# EAGLE design Command Matrix PCB (EAGLE 6.4)

## Sheet 1 of 6
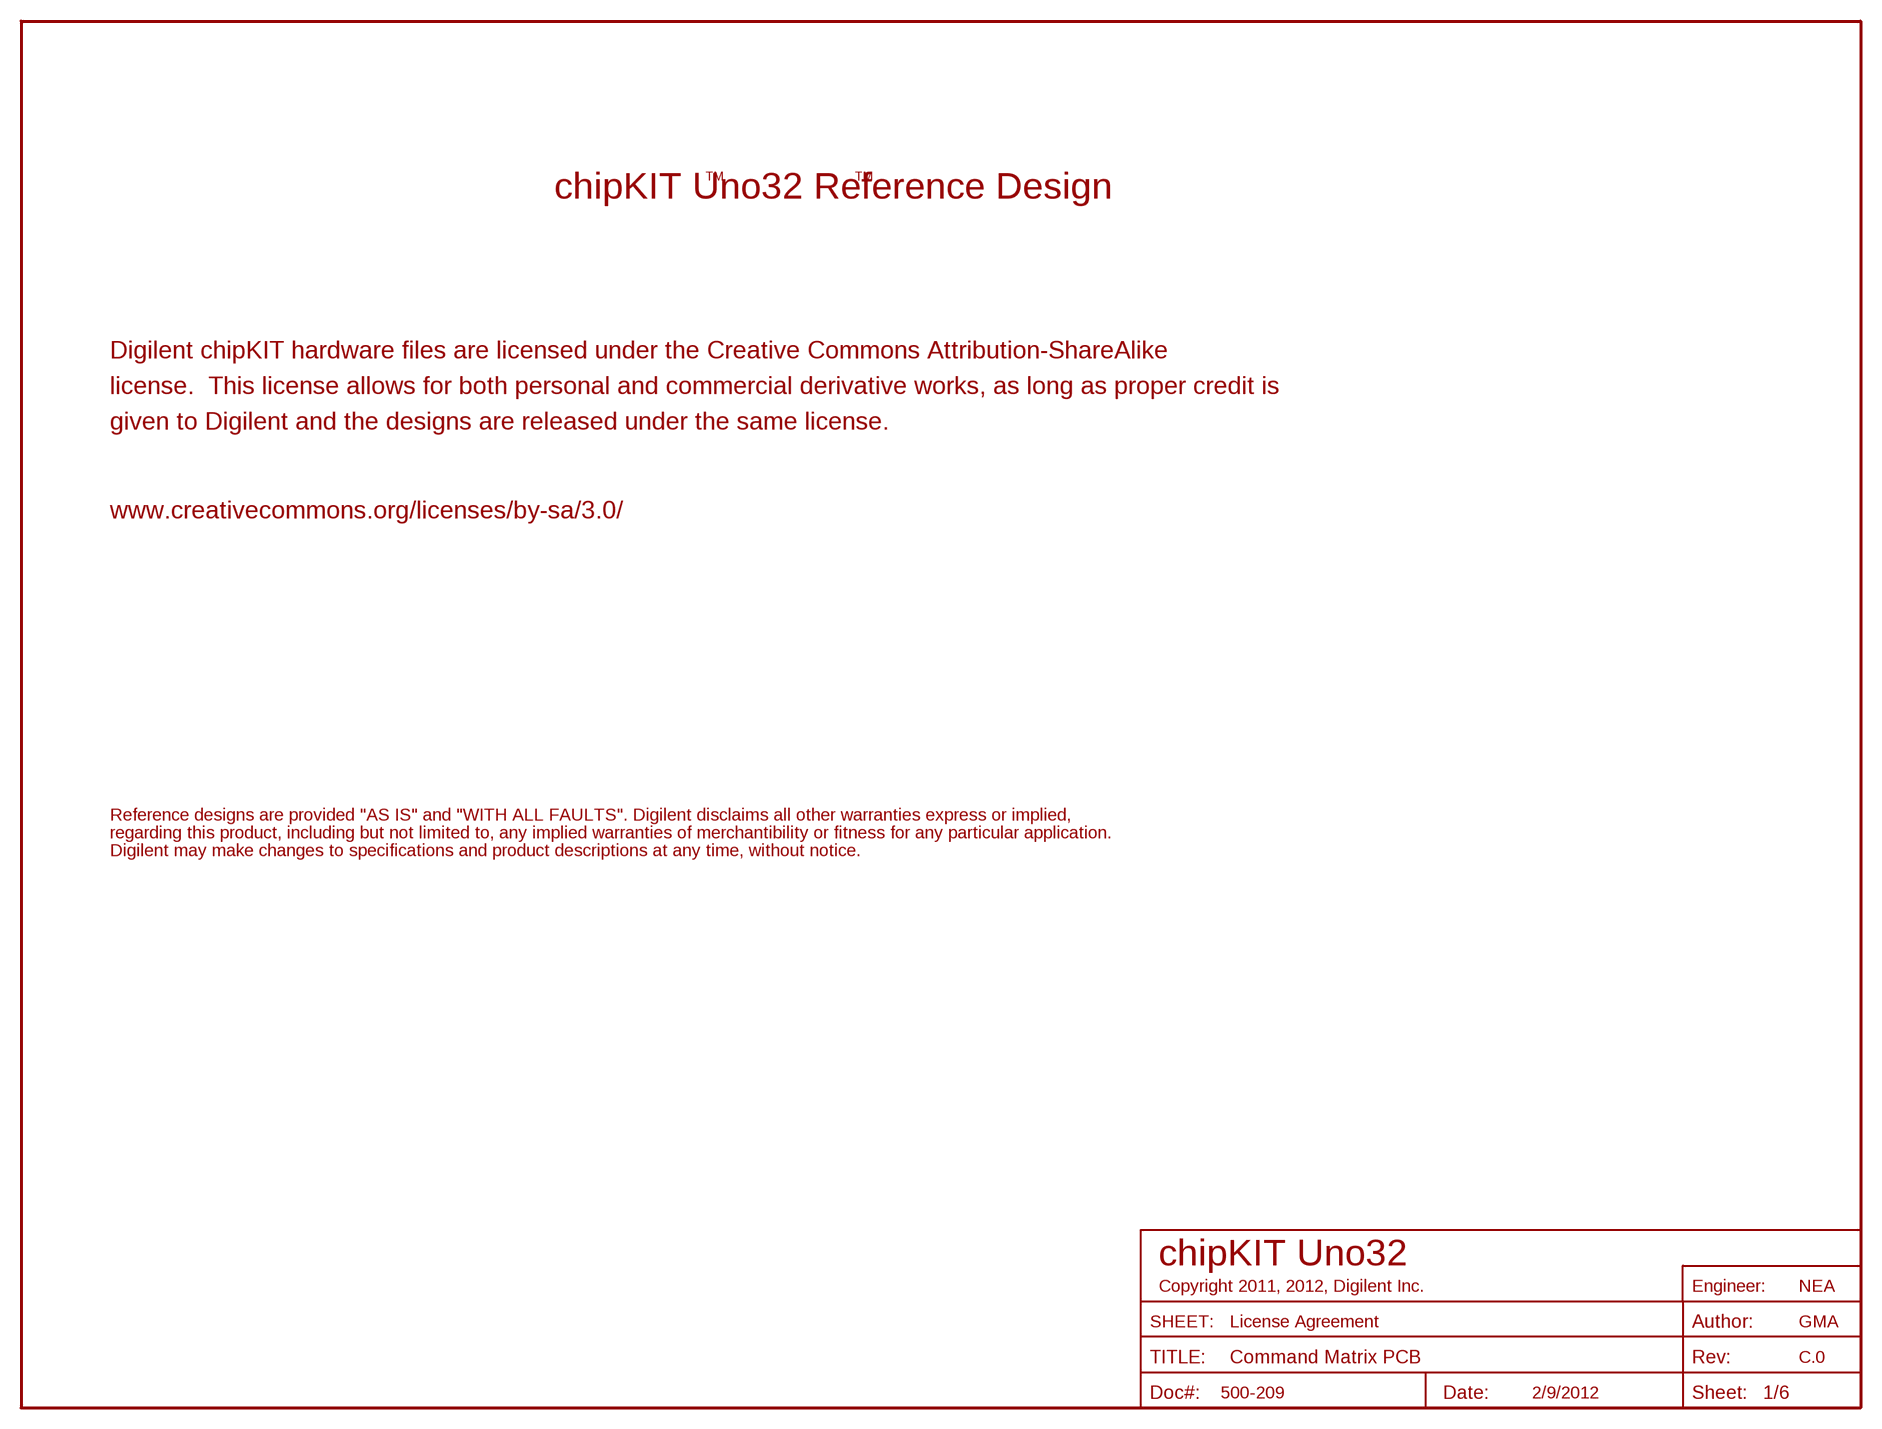
[diagram p0: schematic, sheet 1]

### Notes on the sheet
- TM | TM
- chipKIT Uno32 Reference Design
- Digilent chipKIT hardware files are licensed under the Creative Commons Attribution-ShareAlike
- license.  This license allows for both personal and commercial derivative works, as long as proper credit is
- given to Digilent and the designs are released under the same license.
- www.creativecommons.org/licenses/by-sa/3.0/
- Reference designs are provided "AS IS" and "WITH ALL FAULTS". Digilent disclaims all other warranties express or implied,
- regarding this product, including but not limited to, any implied warranties of merchantibility or fitness for any particular application.
- Digilent may make changes to specifications and product descriptions at any time, without notice.
- chipKIT Uno32
- Copyright 2011, 2012, Digilent Inc. | NEA
- License Agreement | GMA
- C.0
- 500-209 | 2/9/2012

## Sheet 2 of 6
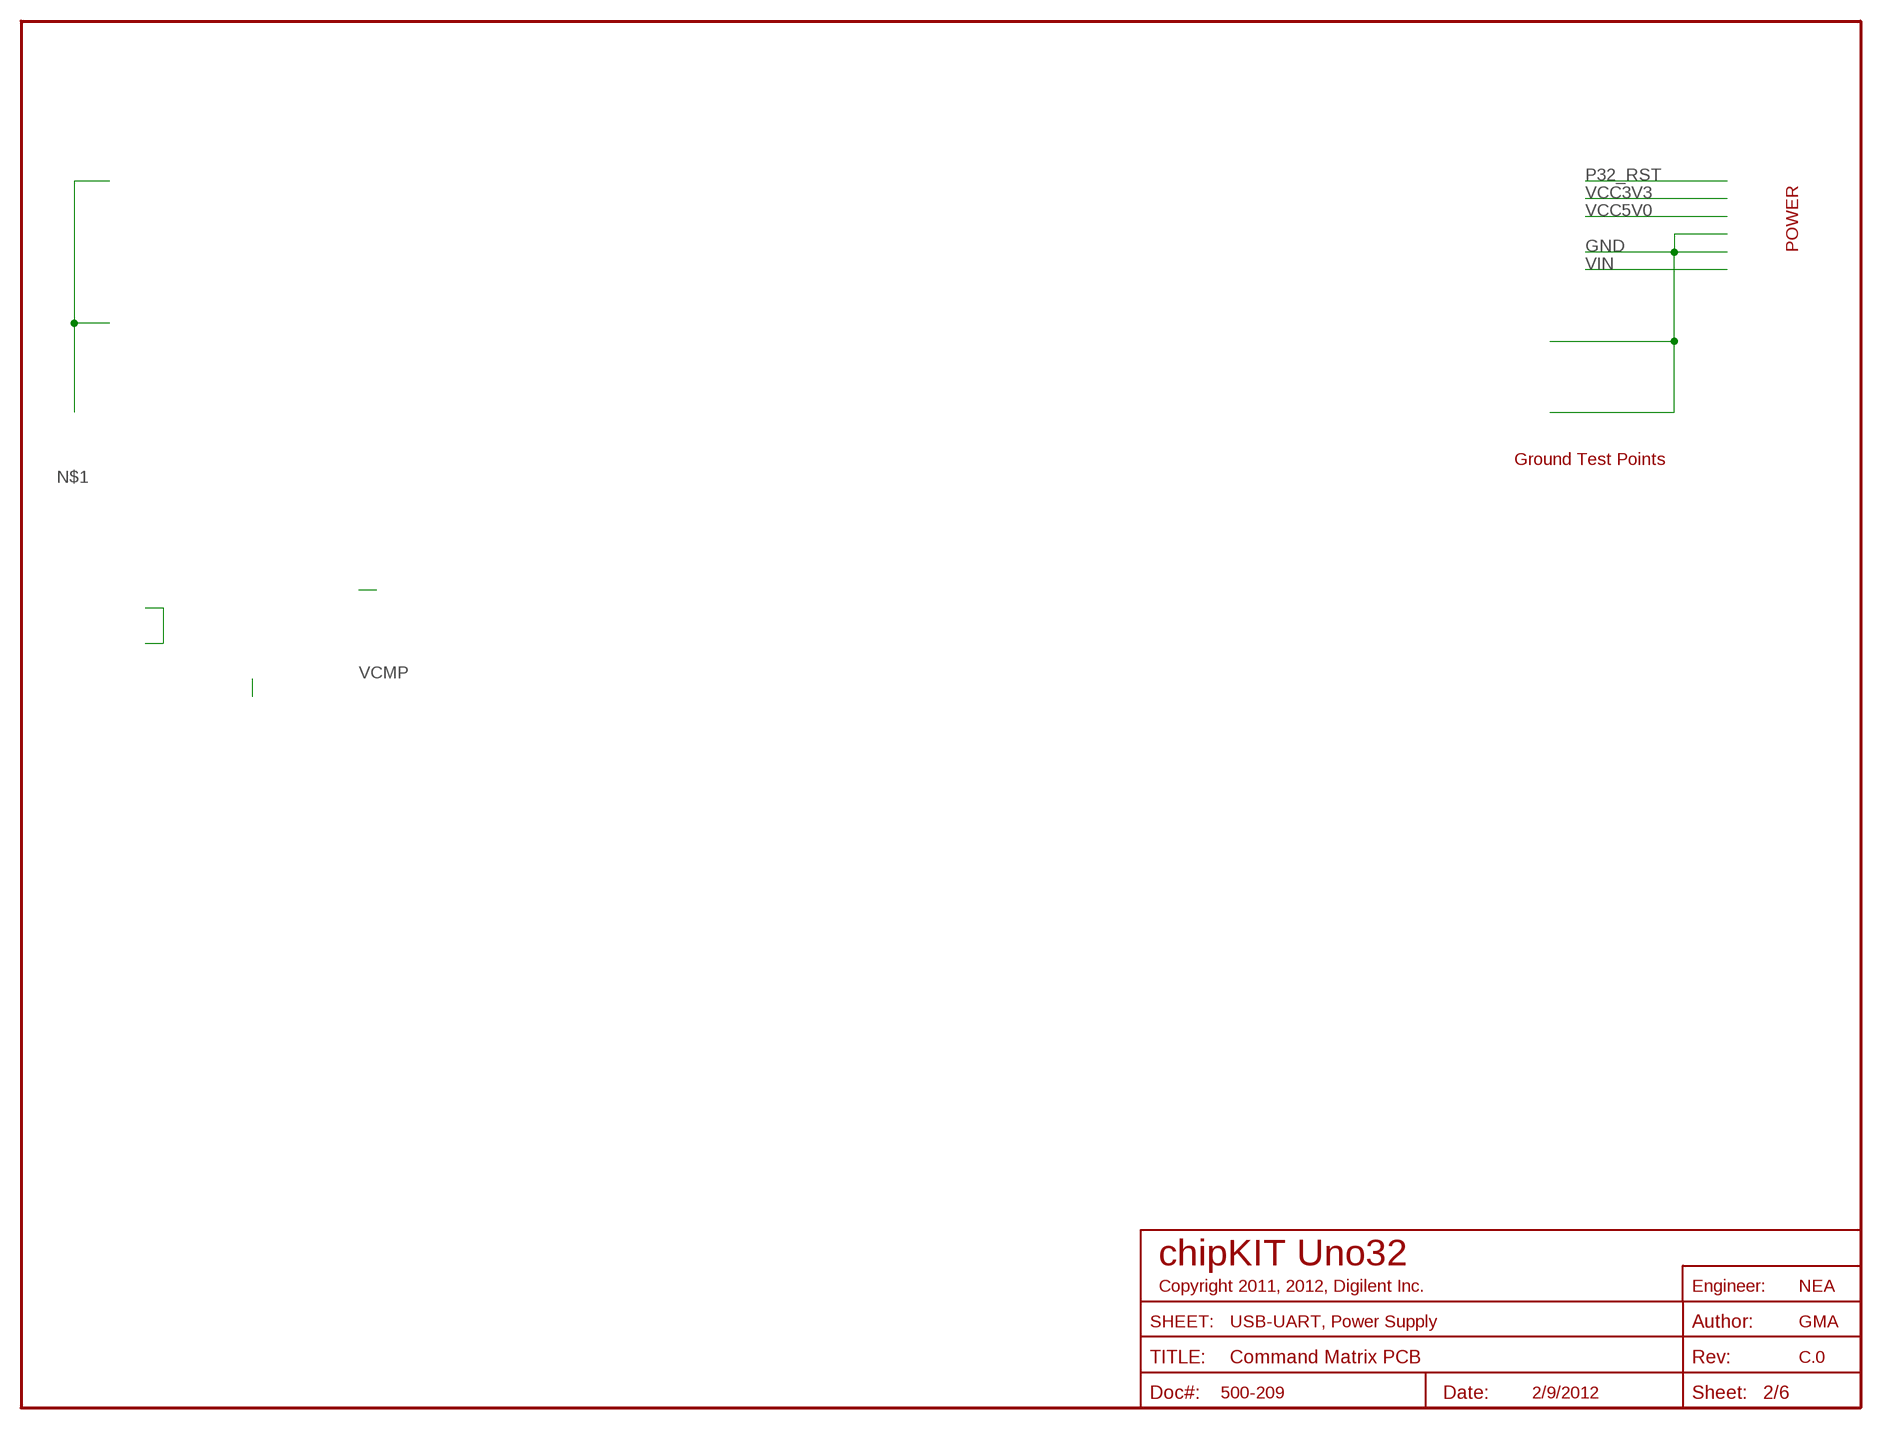
[diagram p1: schematic, sheet 2]

### Notes on the sheet
- POWER
- Ground Test Points
- chipKIT Uno32
- Copyright 2011, 2012, Digilent Inc. | NEA
- USB-UART, Power Supply | GMA
- C.0
- 500-209 | 2/9/2012

## Sheet 3 of 6
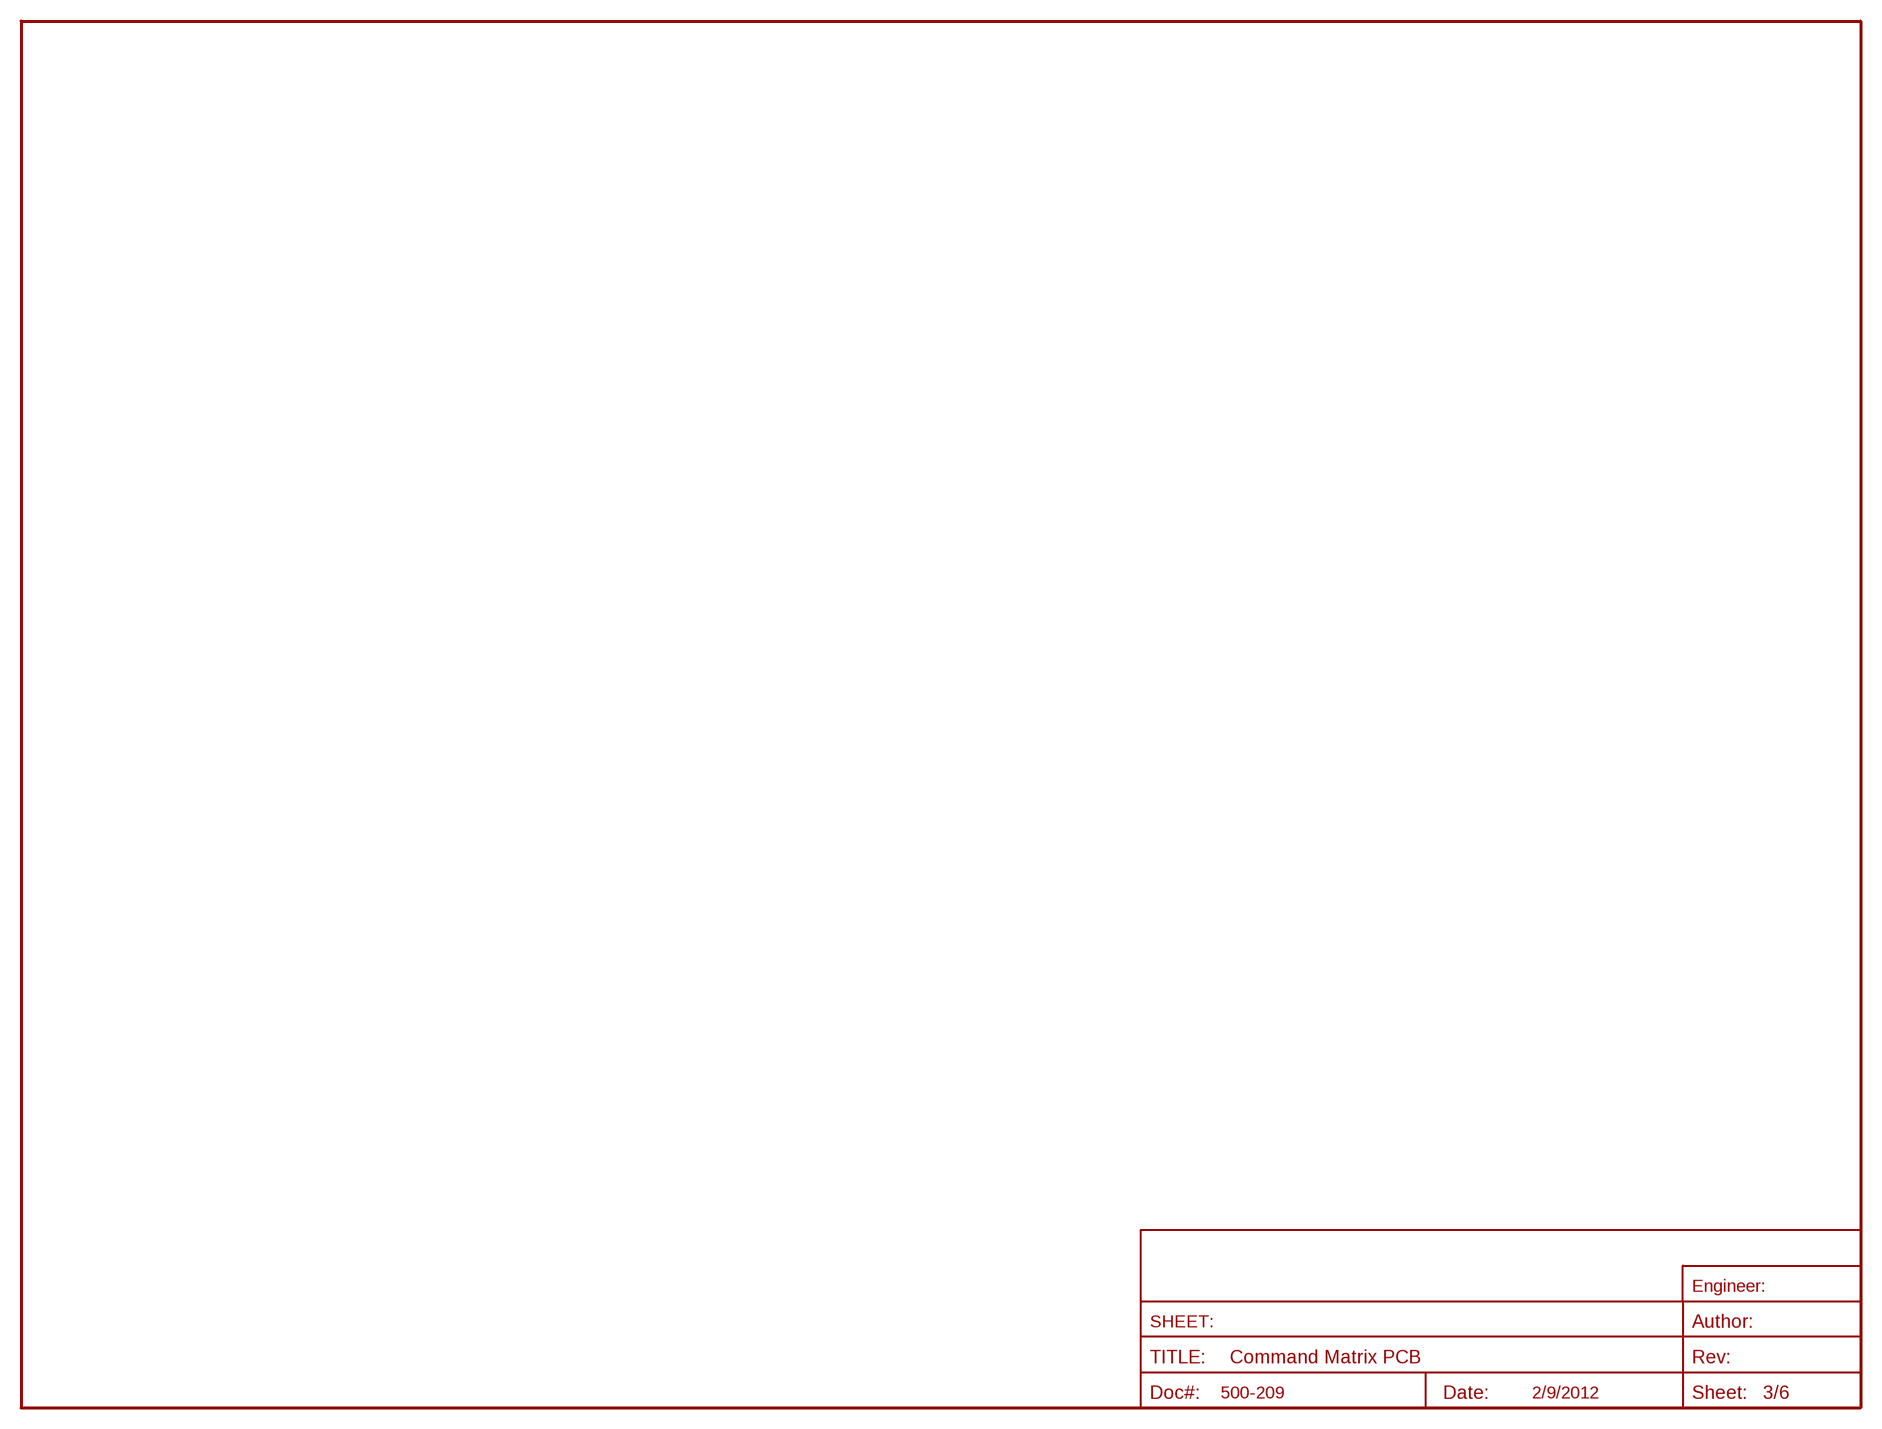
[diagram p2: schematic, sheet 3]

### Notes on the sheet
- 500-209 | 2/9/2012

## Sheet 4 of 6
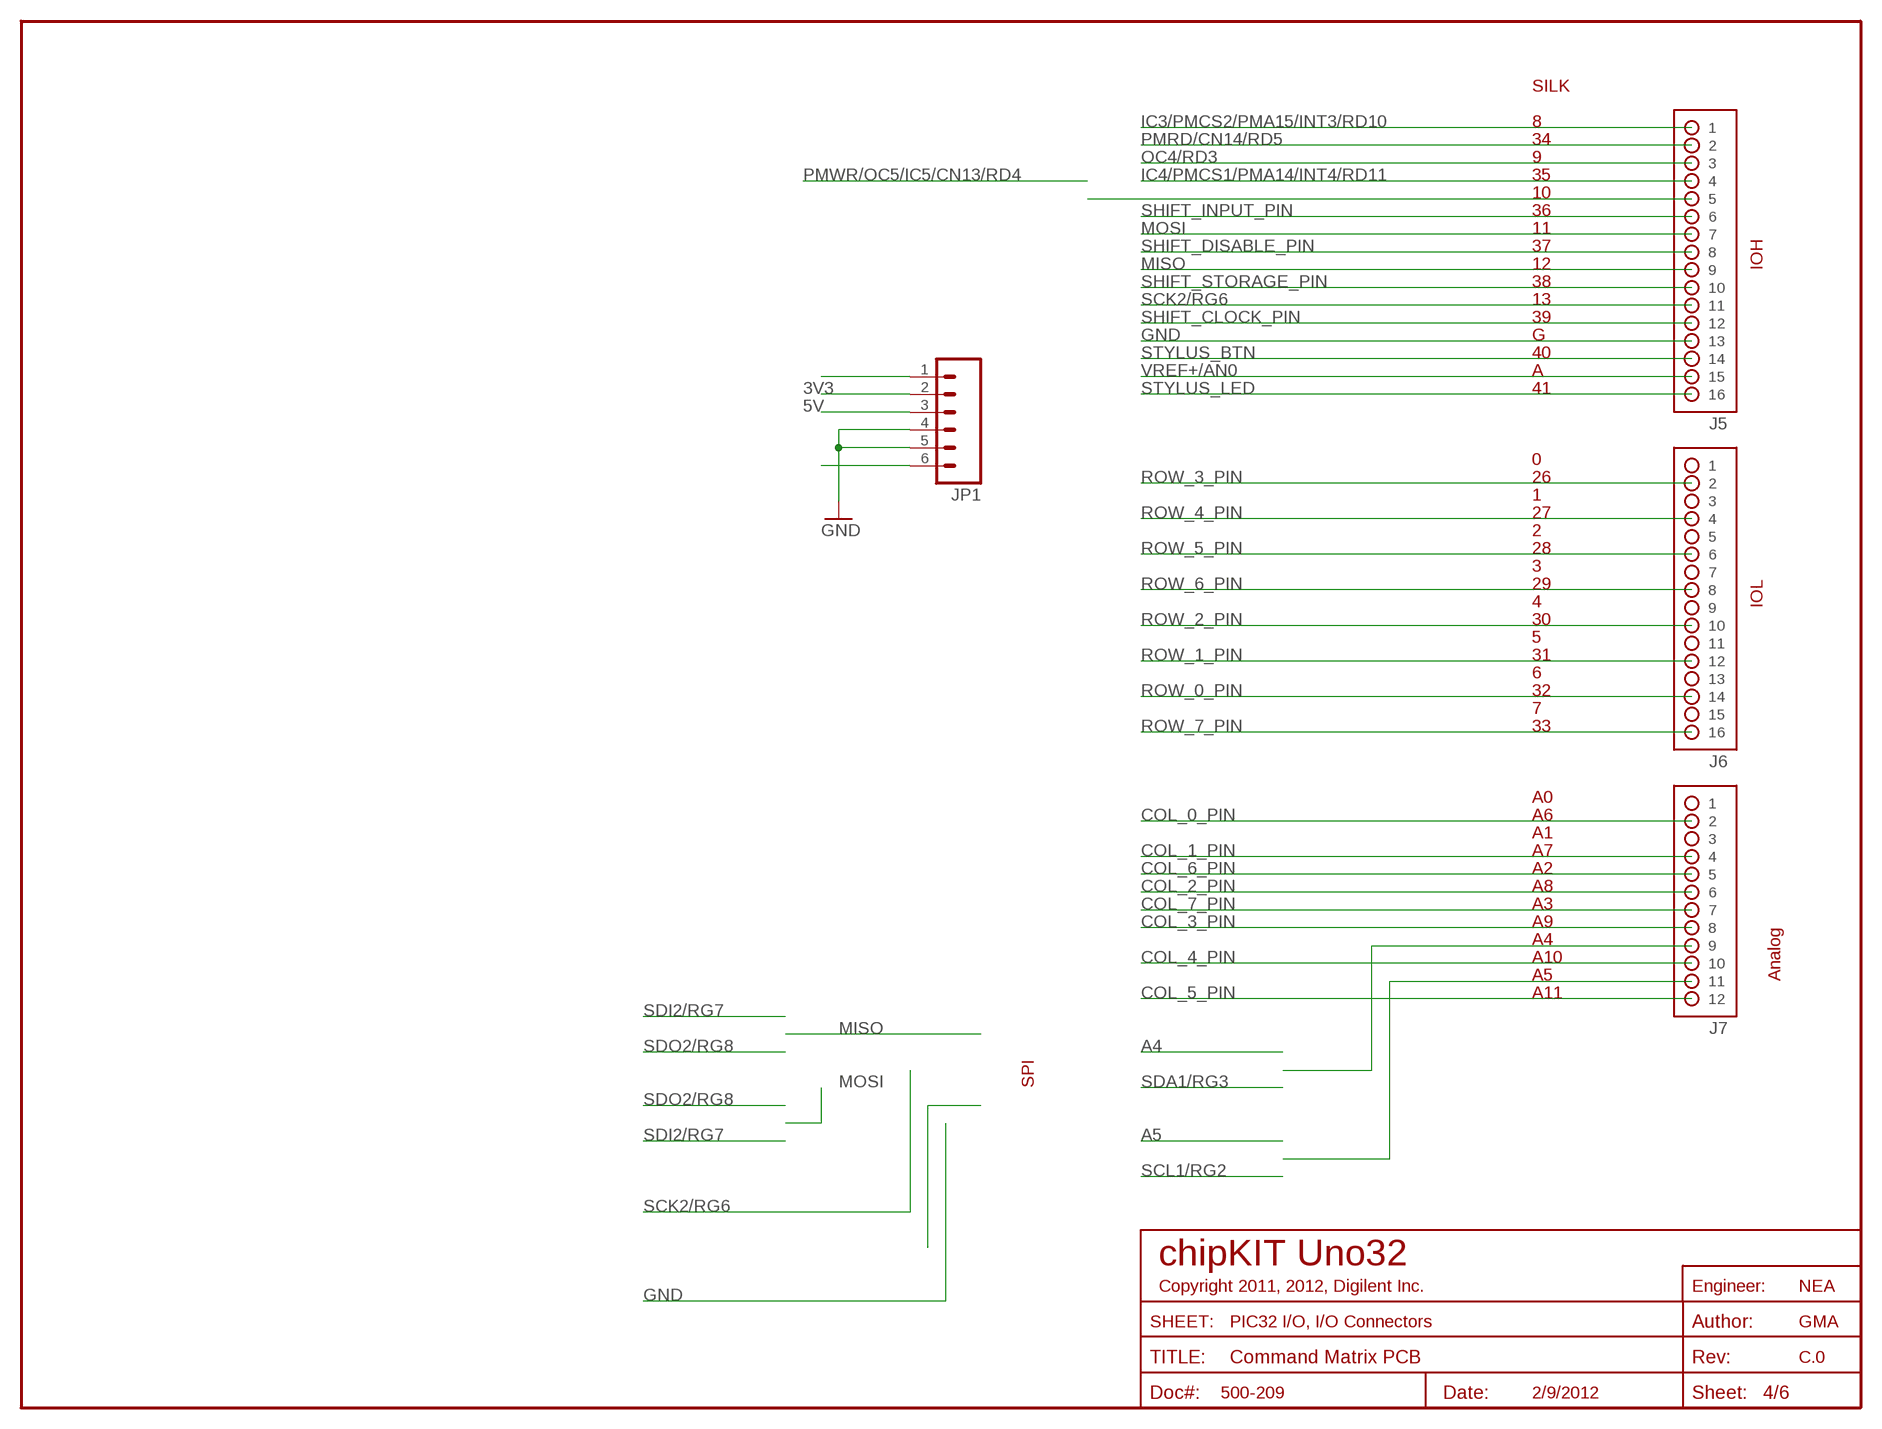
[diagram p3: schematic, sheet 4]

### Parts
J5  HDR-2X8  [HDR-2X8]
J6  HDR-2X8  [HDR-2X8]
J7  HDR-2X6  [HDR-2X6]
JP1  M06SIP  [1X06]

### Nets
3V3: JP1.2 ; also sheet 5
5V: JP1.3 ; also sheet 5
COL_0_PIN: J7.2 ; also sheet 5
COL_1_PIN: J7.4 ; also sheet 5
COL_2_PIN: J7.6 ; also sheet 5
COL_3_PIN: J7.8 ; also sheet 5
COL_4_PIN: J7.10 ; also sheet 5
COL_5_PIN: J7.12 ; also sheet 5
COL_6_PIN: J7.5 ; also sheet 5
COL_7_PIN: J7.7 ; also sheet 5
GND: J5.13 JP1.4 JP1.5 ; also sheet 2,5
IC3/PMCS2/PMA15/INT3/RD10: J5.1
IC4/PMCS1/PMA14/INT4/RD11: J5.4
MISO: J5.9
MOSI: J5.7
N$7: JP1.6
N$25: J5.5
N$32: J7.9
N$33: J7.11
OC4/RD3: J5.3
PMRD/CN14/RD5: J5.2
RESET: JP1.1
ROW_0_PIN: J6.14 ; also sheet 5
ROW_1_PIN: J6.12 ; also sheet 5
ROW_2_PIN: J6.10 ; also sheet 5
ROW_3_PIN: J6.2 ; also sheet 5
ROW_4_PIN: J6.4 ; also sheet 5
ROW_5_PIN: J6.6 ; also sheet 5
ROW_6_PIN: J6.8 ; also sheet 5
ROW_7_PIN: J6.16 ; also sheet 5
SCK2/RG6: J5.11
SHIFT_CLOCK_PIN: J5.12 ; also sheet 5
SHIFT_DISABLE_PIN: J5.8 ; also sheet 5
SHIFT_INPUT_PIN: J5.6 ; also sheet 5
SHIFT_STORAGE_PIN: J5.10 ; also sheet 5
STYLUS_BTN: J5.14 ; also sheet 5
STYLUS_LED: J5.16 ; also sheet 5
VREF+/AN0: J5.15
Unconnected: J6.1 J6.3 J6.5 J6.7 J6.9 J6.11 J6.13 J6.15 J7.1 J7.3

### Notes on the sheet
- SILK
- 8
- 34
- 9
- 35
- 10
- 36
- 11
- 37
- 12 | IOH
- 38
- 13
- 39
- G
- 40
- A
- 41
- 0
- 26
- 1
- 27
- 2
- 28
- 3
- 29
- 4 | IOL
- 30
- 5
- 31
- 6
- 32
- 7
- 33
- A0
- A6
- A1
- A7
- A2
- A8
- A3
- A9
- A4
- A10
- A5 | Analog
- A11
- SPI
- chipKIT Uno32
- Copyright 2011, 2012, Digilent Inc. | NEA
- PIC32 I/O, I/O Connectors | GMA
- C.0
- 500-209 | 2/9/2012

## Sheet 5 of 6
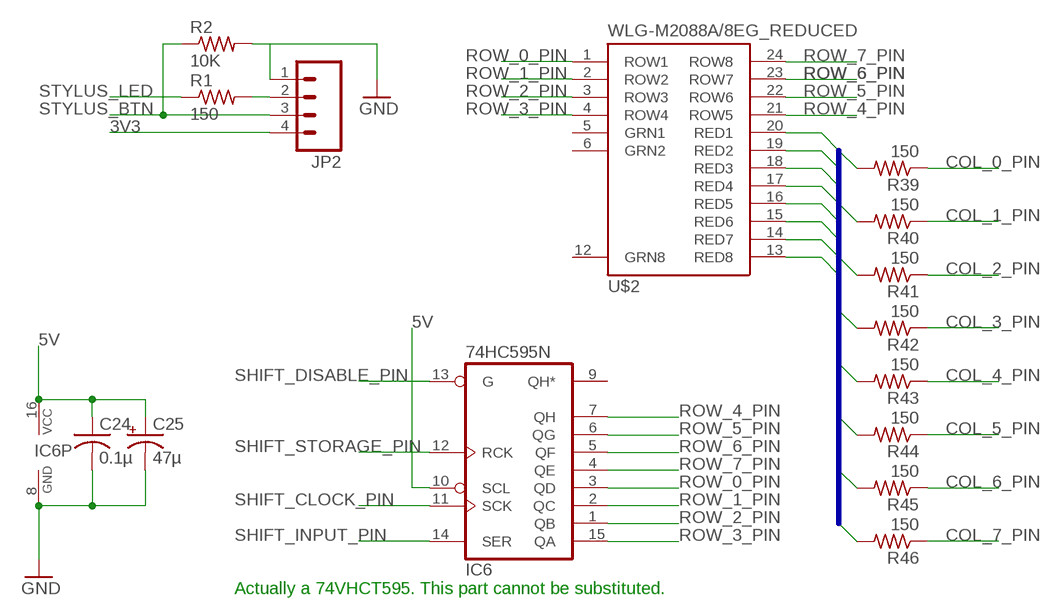
[diagram p4: schematic, sheet 5]

### Parts
C24  0.1µ  C-US025-025X050  [C025-025X050]
C25  47µ  CPOL-USE2,5-6E  [E2,5-6E]
IC6  74HC595N  [DIL16]
JP2  M04PTH  [1X04]
R1  150  R-US_0207/10  [0207/10]
R2  10K  R-US_0207/10  [0207/10]
R39  150  R-US_0207/10  [0207/10]
R40  150  R-US_0207/10  [0207/10]
R41  150  R-US_0207/10  [0207/10]
R42  150  R-US_0207/10  [0207/10]
R43  150  R-US_0207/10  [0207/10]
R44  150  R-US_0207/10  [0207/10]
R45  150  R-US_0207/10  [0207/10]
R46  150  R-US_0207/10  [0207/10]
U$2  WLG-M2088A/8EG_REDUCED  [WLG-M2088A/8EG_REDUCED]

### Nets
3V3: JP2.4 ; also sheet 4
5V: C24.1 C25.+ IC6.10(SCL) IC6.16(VCC) ; also sheet 4
COL_0_PIN: R39.1 ; also sheet 4
COL_1_PIN: R40.1 ; also sheet 4
COL_2_PIN: R41.1 ; also sheet 4
COL_3_PIN: R42.1 ; also sheet 4
COL_4_PIN: R43.1 ; also sheet 4
COL_5_PIN: R44.1 ; also sheet 4
COL_6_PIN: R45.1 ; also sheet 4
COL_7_PIN: R46.1 ; also sheet 4
COLUMN_0: R39.2 U$2.20(RED1)
COLUMN_1: R40.2 U$2.19(RED2)
COLUMN_2: R41.2 U$2.18(RED3)
COLUMN_3: R42.2 U$2.17(RED4)
COLUMN_4: R43.2 U$2.16(RED5)
COLUMN_5: R44.2 U$2.15(RED6)
COLUMN_6: R45.2 U$2.14(RED7)
COLUMN_7: R46.2 U$2.13(RED8)
GND: C24.2 C25.- IC6.8(GND) JP2.1 R2.2 ; also sheet 2,4
N$3: JP2.2 R1.2
ROW_0_PIN: IC6.3(QD) U$2.1(ROW1) ; also sheet 4
ROW_1_PIN: IC6.2(QC) U$2.2(ROW2) ; also sheet 4
ROW_2_PIN: IC6.1(QB) U$2.3(ROW3) ; also sheet 4
ROW_3_PIN: IC6.15(QA) U$2.4(ROW4) ; also sheet 4
ROW_4_PIN: IC6.7(QH) U$2.21(ROW5) ; also sheet 4
ROW_5_PIN: IC6.6(QG) U$2.22(ROW6) ; also sheet 4
ROW_6_PIN: IC6.5(QF) U$2.23(ROW7) ; also sheet 4
ROW_7_PIN: IC6.4(QE) U$2.24(ROW8) ; also sheet 4
SHIFT_CLOCK_PIN: IC6.11(SCK) ; also sheet 4
SHIFT_DISABLE_PIN: IC6.13(G) ; also sheet 4
SHIFT_INPUT_PIN: IC6.14(SER) ; also sheet 4
SHIFT_STORAGE_PIN: IC6.12(RCK) ; also sheet 4
STYLUS_BTN: JP2.3 R2.1 ; also sheet 4
STYLUS_LED: R1.1 ; also sheet 4
Unconnected: IC6.9(QH*) U$2.5(GRN1) U$2.6(GRN2) U$2.12(GRN8)

### Buses
COLUMN_[0..7]

### Notes on the sheet
- Actually a 74VHCT595. This part cannot be substituted.

## Sheet 6 of 6
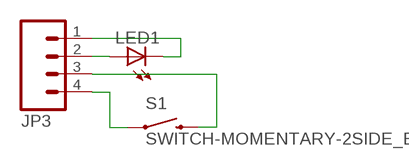
[diagram p5: schematic, sheet 6]

### Parts
JP3  M04PTH  [1X04]
LED1  LEDSIDEWAYS  [LEDSIDEWAYS]
S1  SWITCH-MOMENTARY-2SIDE_EZ  [TACTILE-PTH-SIDEEZ]

### Nets
N$4: JP3.2 LED1.P$1(A)
N$5: JP3.1 LED1.P$2(C)
N$6: JP3.3 S1.2
N$8: JP3.4 S1.1

## Library data of the parts
C24 = rcl:C-US: CAPACITOR, American symbol
C25 = rcl:CPOL-US: POLARIZED CAPACITOR, American symbol
IC6 = 74xx-eu:74*595: 8-bit SHIFT REGISTER, output latch
J5 J6 = Mechanical:HDR-2X8: 100mil 2x8 header
J7 = Mechanical:HDR-2X6: 2x6 header with 42mil holes and 100mil spacing
JP1 = SparkFun-Connectors:M06: Header 6 Standard 6-pin 0.1" header. Use with straight break away headers (SKU : PRT-00116), right angle break away headers (PRT-00553), swiss pins (PRT-00743), machine pins (PRT-00117), and female headers (PRT-00115). Molex polarized connector foot print use with SKU : PRT-08094 with associated crimp pins and housings. NOTES ON THE VARIANTS LOCK and LOCK_LONGPADS... This footprint was designed to help hold the alignment of a through-hole component (i.e. 6-pin header) while soldering it into place. You may notice that each hole has been shifted either up or down by 0.005 of an inch from it's more standard position (which is a perfectly straight line). This slight alteration caused the pins (the squares in the middle) to touch the edges of the holes. Because they are alternating, it causes a "brace" to hold the component in place. 0.005 has proven to be the perfect amount of "off-center" position when using our standard breakaway headers. Although looks a little odd when you look at the bare footprint, once you have a header in there, the alteration is very hard to notice. Also, if you push a header all the way into place, it is covered up entirely on the bottom side. This idea of altering the position of holes to aid alignment will be further integrated into the Sparkfun Library for other footprints. It can help hold any component with 3 or more connection pins.
JP2 JP3 = SparkFun-Connectors:M04: Header 4 Standard 4-pin 0.1" header. Use with straight break away headers (SKU : PRT-00116), right angle break away headers (PRT-00553), swiss pins (PRT-00743), machine pins (PRT-00117), and female headers (PRT-00115). Molex polarized connector foot print use with SKU : PRT-08231 with associated crimp pins and housings. 1MM SMD Version SKU: PRT-10208
LED1 = SparkFun-LED:LED: LEDs Standard schematic elements and footprints for 5mm, 3mm, 1206, and 0603 sized LEDs. 5mm - Spark Fun Electronics SKU : COM-00529 (and others)
R1 R2 R39-R46 = rcl:R-US_: RESISTOR, American symbol
S1 = SparkFun-Electromechanical:SWITCH-MOMENTARY-2: Various NO switches- pushbuttons, reed, etc
U$2 = led-matrix-v3:WLG-M2088A/8EG_REDUCED

## Board
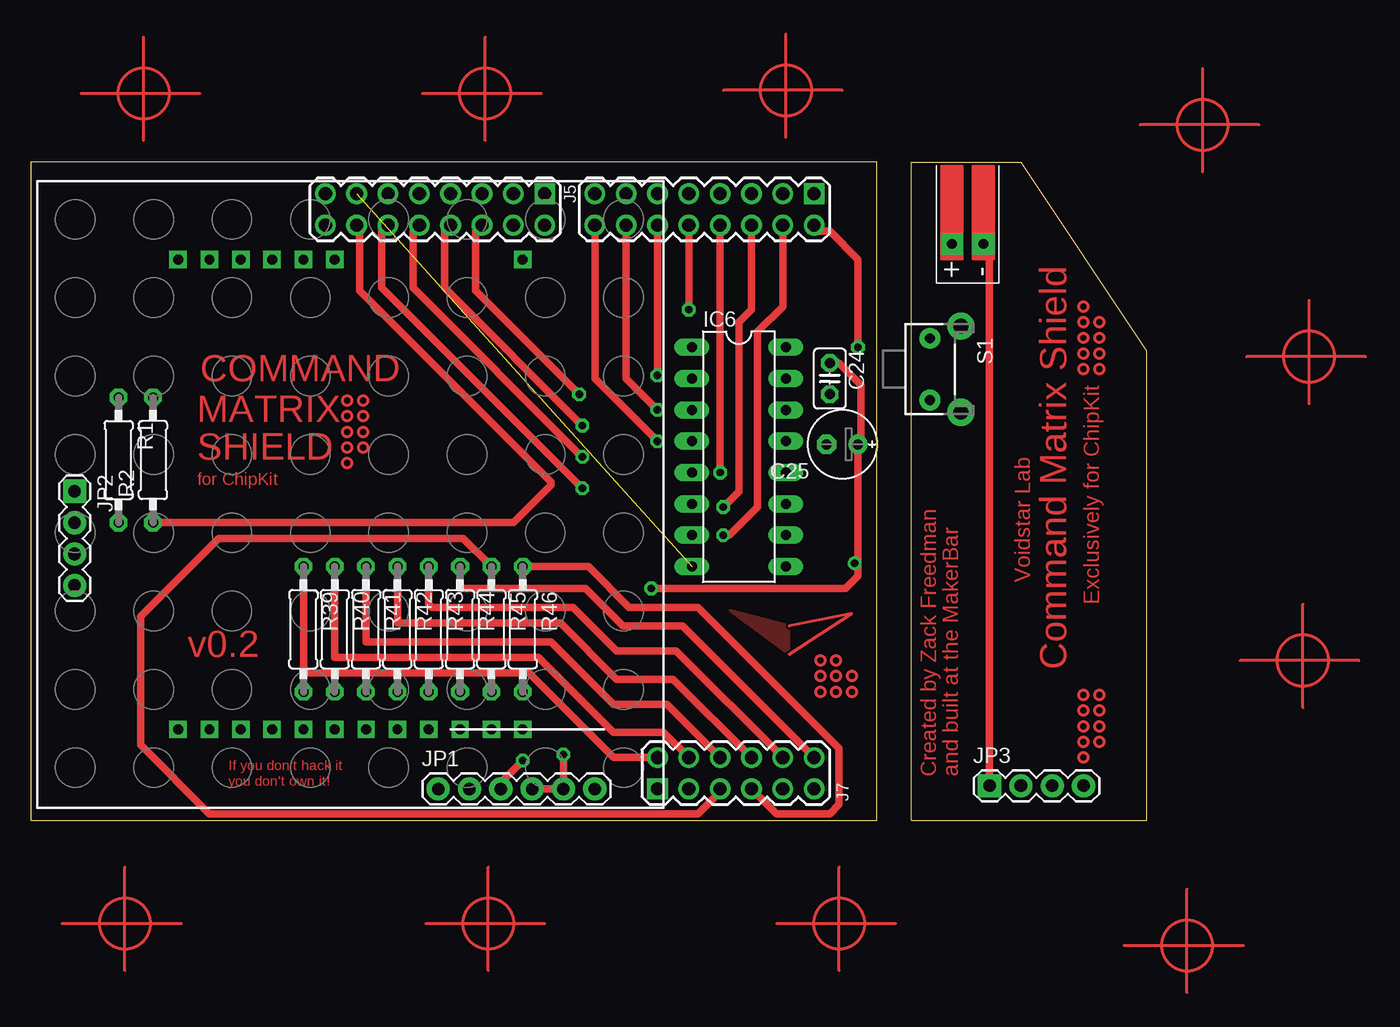
[diagram p6: board, top side]
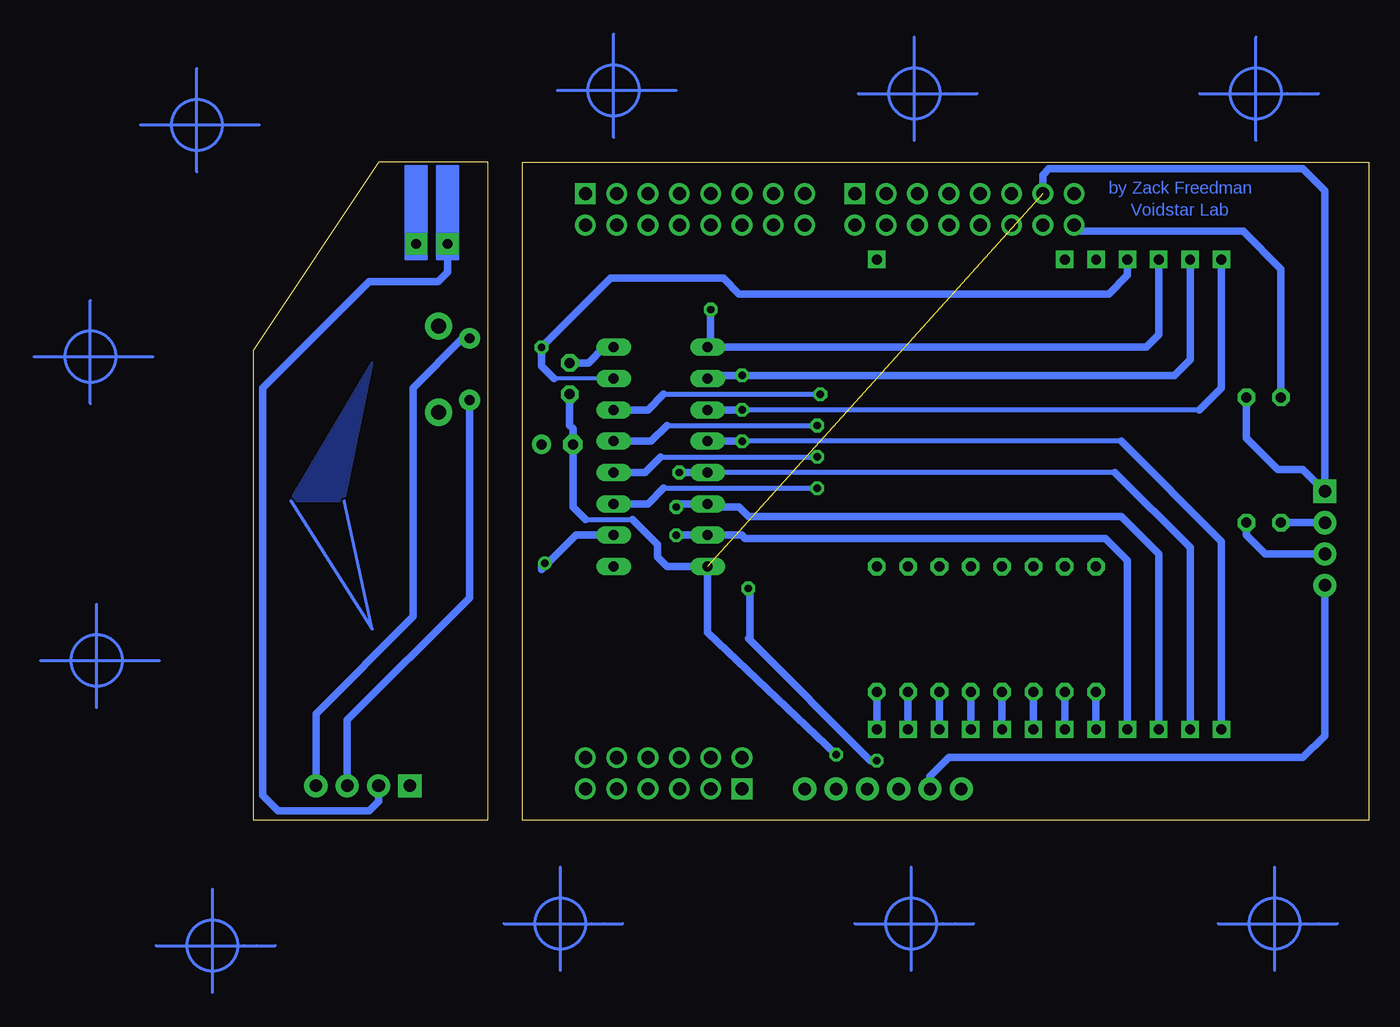
[diagram p7: board, bottom side, seen from below]

Size 90.42 x 53.34 mm. Coordinates in mm from the lower left corner, seen from the top.
Outline: 0,0 68.58,0 68.58,53.34 0,53.34 0,0
Outline: 71.37,0 90.42,0 90.42,38.1 80.26,53.34 71.37,53.34 71.37,0
Copper layers (1+2*15+16): Top 0.035mm / dielectric 0.2mm / Route2 0.035mm / dielectric 0.2mm / Route15 0.035mm / dielectric 0.2mm / Bottom 0.035mm
Design rules "default *": minimum track width 8mil, minimum drill 0.3mm, track to track 6mil, track to pad 6mil, pad to pad 6mil, via to via 6mil, smd to smd 0mil, copper to edge 10mil, drill to drill 8mil, minimum pad ring 12mil, minimum via ring 10mil, stop-mask expansion 4mil, vias tented up to drill 15mil, thermal gap 6mil

### Footprints (pad centres in the part's own frame; a part is rotated, then mirrored left to right if it is on the bottom)
C025-025X050 = drill 0.813 octagon: 1 -1.27,0; 2 1.27,0
E2,5-6E = drill 0.813 pad 1.575: + -1.27,0 | drill 0.813 pad 1.575 octagon: - 1.27,0
DIL16 = drill 0.813 long: 1 -8.89,-3.81; 2 -6.35,-3.81; 3 -3.81,-3.81; 4 -1.27,-3.81; 5 1.27,-3.81; 6 3.81,-3.81; 7 6.35,-3.81; 8 8.89,-3.81; 9 8.89,3.81; 10 6.35,3.81; 11 3.81,3.81; 12 1.27,3.81; 13 -1.27,3.81; 14 -3.81,3.81; 15 -6.35,3.81; 16 -8.89,3.81
HDR-2X8 = drill 1.067 square: 1 -1.27,8.89 | drill 1.067: 2 1.27,8.89; 3 -1.27,6.35; 4 1.27,6.35; 5 -1.27,3.81; 6 1.27,3.81; 7 -1.27,1.27; 8 1.27,1.27; 9 -1.27,-1.27; 10 1.27,-1.27; 11 -1.27,-3.81; 12 1.27,-3.81; 13 -1.27,-6.35; 14 1.27,-6.35; 15 -1.27,-8.89; 16 1.27,-8.89
HDR-2X6 = drill 1.067 square: 1 -1.27,6.35 | drill 1.067: 2 1.27,6.35; 3 -1.27,3.81; 4 1.27,3.81; 5 -1.27,1.27; 6 1.27,1.27; 7 -1.27,-1.27; 8 1.27,-1.27; 9 -1.27,-3.81; 10 1.27,-3.81; 11 -1.27,-6.35; 12 1.27,-6.35
1X06 = drill 1.016 pad 1.88: 1 0,0; 2 2.54,0; 3 5.08,0; 4 7.62,0; 5 10.16,0; 6 12.7,0
1X04 = drill 1.016 pad 1.88 square: 1 0,0 | drill 1.016 pad 1.88: 2 2.54,0; 3 5.08,0; 4 7.62,0
LEDSIDEWAYS = drill 0.8 pad 1.778 square: P$1 -1.27,0; P$2 1.27,0
0207/10 = drill 0.813 octagon: 1 -5.08,0; 2 5.08,0
TACTILE-PTH-SIDEEZ = drill 0.8 pad 1.7: 1 -2.5,0; 2 2.5,0 | drill 1.2 pad 2.2: ANCHOR1 -3.5,2.5; ANCHOR2 3.5,2.5
WLG-M2088A/8EG_REDUCED = drill 0.8 square: 1 -13.97,19.05; 2 -11.43,19.05; 3 -8.89,19.05; 4 -6.35,19.05; 5 -3.81,19.05; 6 -1.27,19.05; 12 13.97,19.05; 13 13.97,-19.05; 14 11.43,-19.05; 15 8.89,-19.05; 16 6.35,-19.05; 17 3.81,-19.05; 18 1.27,-19.05; 19 -1.27,-19.05; 20 -3.81,-19.05; 21 -6.35,-19.05; 22 -8.89,-19.05; 23 -11.43,-19.05; 24 -13.97,-19.05

### Placement (x,y rotation side)
C24  64.77,35.81 270 top
C25  65.79,30.48 180 top
IC6  57.4,29.46 270 top
J5  32.77,49.53 270 top
J6  54.61,49.53 270 top
J7  57.15,3.81 90 top
JP1  33.02,2.54 0 top
JP2  3.56,26.67 270 top
JP3  77.72,2.79 0 top
LED1  75.95,46.74 0 top
R1  7.11,29.21 270 top
R2  9.91,29.21 90 top
R39  22.1,15.49 270 top
R40  24.64,15.49 270 top
R41  27.18,15.49 270 top
R42  29.72,15.49 270 top
R43  32.26,15.49 270 top
R44  34.8,15.49 270 top
R45  37.34,15.49 270 top
R46  39.88,15.49 270 top
S1  72.9,36.58 270 top
U$2  25.91,26.42 0 top

### Tracks (layer width: path | path; a pad name or v marks a point on that pad's centre or on a via)
3V3
  Bottom 0.61: JP1.2 35.56,3.56 34.04,5.08 5.33,5.08 3.56,6.86 JP2.4
5V  (via drill 0.6)
  Top 0.61: C24.1 65.53,37.08 67.31,35.31 67.31,30.73 C25.+ 67.06,20.83 v66.8,20.83 67.06,20.57 67.06,19.81 66.04,18.8 v50.29,18.8 | JP1.3 38.1,3.05 v39.88,4.83
  Bottom 0.61: IC6.16 61.98,38.35 63.25,37.08 C24.1 | v39.88,4.83 40.39,4.83 50.16,14.61 | 50.16,14.61 50.29,14.73 | v50.29,18.8 50.16,18.67 50.16,14.61 | IC6.10 64.26,23.11 67.06,20.32 67.06,20.57 v66.8,20.83
COL_0_PIN
  Top 0.61: R39.1 22.1,11.94 40.39,11.94 47.24,5.08 J7.2
COL_1_PIN
  Top 0.61: R40.1 24.64,13.21 41.15,13.21 47.24,7.11 51.31,7.11 J7.4
COL_2_PIN
  Top 0.61: R41.1 27.18,14.48 42.16,14.48 47.24,9.4 51.56,9.4 J7.6
COL_3_PIN
  Top 0.61: R42.1 29.72,16 42.93,16 47.5,11.43 52.07,11.43 J7.8
COL_4_PIN
  Top 0.61: R43.1 32.26,17.53 32.51,17.27 43.94,17.27 47.5,13.72 52.32,13.72 J7.10
COL_5_PIN
  Top 0.61: R44.1 34.8,18.8 44.96,18.8 48.01,15.75 52.83,15.75 J7.12
COL_6_PIN
  Top 0.61: J7.5 55.88,2.29 54.1,0.51 14.48,0.51 8.89,6.1 8.89,16.51 15.24,22.86 35.05,22.86 R45.1
COL_7_PIN
  Top 0.61: R46.1 45.21,20.57 48.51,17.27 54.1,17.27 65.53,5.84 65.53,1.27 64.77,0.51 60.45,0.51 J7.7
COLUMN_0
  Bottom 0.61: U$2.20 R39.2
COLUMN_1
  Bottom 0.61: U$2.19 R40.2
COLUMN_2
  Bottom 0.61: U$2.18 R41.2
COLUMN_3
  Bottom 0.61: U$2.17 R42.2
COLUMN_4
  Bottom 0.61: R43.2 U$2.16
COLUMN_5
  Bottom 0.61: U$2.15 R44.2
COLUMN_6
  Bottom 0.61: R45.2 U$2.14
COLUMN_7
  Bottom 0.61: U$2.13 R46.2
GND  (via drill 0.6)  (1 unrouted)
  Top 0.61: JP1.4 JP1.5 v43.18,5.33
  Bottom 0.406: 63.5,24.38 59.69,24.38
  Bottom 0.61: C24.2 64.77,32 64.52,31.75 C25.- 64.52,25.4 63.5,24.38 | 59.69,24.38 57.66,22.35 57.66,21.34 56.9,20.57 IC6.8 53.59,15.24 v43.18,5.33 | J5.13 26.42,52.32 25.91,52.83 5.33,52.83 3.56,51.05 JP2.1 | JP2.1 3.56,27.94 | R2.2 9.91,30.99 7.37,28.45 5.33,28.45 JP2.1
N$1
  pour Top: 56.64,17.02 61.47,13.46 61.47,15.75
N$2
  Top 0.254: 61.47,13.46 66.55,16.76 61.47,15.75
N$3
  Bottom 0.61: JP2.2 R1.2
N$4
  Bottom 0.61: JP3.2 80.26,1.52 81.03,0.76 88.39,0.76 89.66,2.03 89.66,35.05 81.03,43.69 75.44,43.69 74.68,44.45 LED1.P$1
N$5
  Top 0.61: JP3.1 77.72,46.23 LED1.P$2
N$6
  Bottom 0.61: S1.2 72.9,18.03 82.8,8.13 JP3.3
N$8
  Bottom 0.61: S1.1 73.45,39.08 77.47,35.05 77.47,16.51 85.34,8.64 JP3.4
N$9
  pour Bottom: 80.77,37.08 87.38,25.91 83.06,25.91
N$10
  Bottom 0.254: 87.38,25.91 80.77,15.49 83.06,25.91
N$11
  Top 0.254: 9.14,55.12 9.14,63.5
N$12
  Top 0.254: 13.72,58.93 4.06,58.93
N$13
  Top 0.254: 36.83,55.12 36.83,63.5
N$14
  Top 0.254: 41.4,58.93 31.75,58.93
N$15
  Top 0.254: 61.21,55.37 61.21,63.75
N$16
  Top 0.254: 65.79,59.18 56.13,59.18
N$17
  Top 0.254: 95,52.58 95,60.96
N$18
  Top 0.254: 99.57,56.39 89.92,56.39
N$19
  Top 0.254: 103.63,33.78 103.63,42.16
N$20
  Top 0.254: 108.2,37.59 98.55,37.59
N$21
  Top 0.254: 103.12,9.14 103.12,17.53
N$22
  Top 0.254: 107.7,12.95 98.04,12.95
N$23
  Top 0.254: 7.62,-12.19 7.62,-3.81
N$24
  Top 0.254: 12.19,-8.38 2.54,-8.38
N$26
  Top 0.254: 37.08,-12.19 37.08,-3.81
N$27
  Top 0.254: 41.66,-8.38 32,-8.38
N$28
  Top 0.254: 65.53,-12.19 65.53,-3.81
N$29
  Top 0.254: 70.1,-8.38 60.45,-8.38
N$30
  Top 0.254: 93.73,-13.97 93.73,-5.59
N$31
  Top 0.254: 98.3,-10.16 88.65,-10.16
N$34
  Bottom 0.254: 9.14,55.12 9.14,63.5
N$35
  Bottom 0.254: 13.72,58.93 6.6,58.93 5.59,58.93 4.06,58.93
N$36
  Bottom 0.254: 36.83,55.12 36.83,63.5
N$37
  Bottom 0.254: 41.4,58.93 34.29,58.93 33.27,58.93 31.75,58.93
N$38
  Bottom 0.254: 61.21,55.37 61.21,63.75
N$39
  Bottom 0.254: 65.79,59.18 58.67,59.18 57.66,59.18 56.13,59.18
N$40
  Bottom 0.254: 95,52.58 95,60.96
N$41
  Bottom 0.254: 99.57,56.39 92.46,56.39 91.44,56.39 89.92,56.39
N$42
  Bottom 0.254: 103.63,33.78 103.63,42.16
N$43
  Bottom 0.254: 108.2,37.59 101.09,37.59 100.08,37.59 98.55,37.59
N$44
  Bottom 0.254: 103.12,9.14 103.12,17.53
N$45
  Bottom 0.254: 107.7,12.95 100.58,12.95 99.57,12.95 98.04,12.95
N$46
  Bottom 0.254: 7.62,-12.19 7.62,-3.81
N$47
  Bottom 0.254: 12.19,-8.38 5.08,-8.38 4.06,-8.38 2.54,-8.38
N$48
  Bottom 0.254: 37.08,-12.19 37.08,-3.81
N$49
  Bottom 0.254: 41.66,-8.38 34.54,-8.38 33.53,-8.38 32,-8.38
N$50
  Bottom 0.254: 65.53,-12.19 65.53,-3.81
N$51
  Bottom 0.254: 70.1,-8.38 62.99,-8.38 61.98,-8.38 60.45,-8.38
N$52
  Bottom 0.254: 93.73,-13.97 93.73,-5.59
N$53
  Bottom 0.254: 98.3,-10.16 91.19,-10.16 90.17,-10.16 88.65,-10.16
ROW_0_PIN  (via drill 0.6)
  Top 0.61: J6.14 48.26,35.81 v50.8,33.27
  Bottom 0.406: 13.72,33.27 v50.8,33.27
  Bottom 0.61: U$2.1 11.94,35.05 13.72,33.27 | 53.34,33.27 IC6.3 v50.8,33.27
ROW_1_PIN  (via drill 0.6)
  Top 0.61: J6.12 v50.8,36.07
  Bottom 0.61: U$2.2 14.48,37.34 15.75,36.07 v50.8,36.07 53.34,36.07 IC6.2
ROW_2_PIN  (via drill 0.6)
  Top 0.61: J6.10 v53.34,41.4
  Bottom 0.61: U$2.3 17.02,39.37 18.03,38.35 IC6.1 53.34,38.61 v53.34,41.4
ROW_3_PIN  (via drill 0.6)
  Top 0.61: J6.2 64.01,47.75 64.77,47.75 67.06,45.47 v67.06,38.35
  Bottom 0.305: IC6.15 66.04,35.81
  Bottom 0.61: U$2.4 19.56,44.2 21.08,42.67 51.05,42.67 52.32,43.94 61.47,43.94 v67.06,38.35 67.06,36.83 66.04,35.81
ROW_4_PIN  (via drill 0.6)
  Top 0.61: J6.4 60.96,41.66 58.93,39.62 58.93,25.4 56.64,23.11 v56.13,23.11
  Bottom 0.61: U$2.21 19.56,21.08 21.34,22.86 50.55,22.86 50.8,23.11 IC6.7 v56.13,23.11
ROW_5_PIN  (via drill 0.6)
  Top 0.61: v56.13,25.4 57.4,26.67 57.4,40.39 58.42,41.4 J6.6
  Bottom 0.61: U$2.22 17.02,21.59 20.07,24.64 50.29,24.64 51.05,25.4 53.34,25.4 IC6.6 55.88,25.65 v56.13,25.4
ROW_6_PIN  (via drill 0.6)
  Top 0.61: J6.8 v55.88,28.19
  Bottom 0.406: 20.57,28.19 IC6.5
  Bottom 0.61: U$2.23 14.48,22.1 20.57,28.19 | 55.37,28.19 v55.88,28.19 IC6.5
ROW_7_PIN  (via drill 0.6)
  Top 0.61: J6.16 45.72,35.81 v50.8,30.73
  Bottom 0.406: 20.07,30.73 v50.8,30.73
  Bottom 0.61: U$2.24 11.94,22.61 20.07,30.73 | v50.8,30.73 IC6.4
SHIFT_CLOCK_PIN  (via drill 0.6)
  Top 0.61: v44.7,26.92 28.45,43.18 28.45,47.75 J5.12
  Bottom 0.406: 57.15,26.92 v44.7,26.92
  Bottom 0.61: IC6.11 58.42,25.65 57.15,26.92
SHIFT_DISABLE_PIN  (via drill 0.6)
  Top 0.61: v44.7,32 33.53,43.18 33.53,47.75 J5.8
  Bottom 0.406: 56.9,32 v44.7,32
  Bottom 0.61: IC6.13 58.17,30.73 56.9,32
SHIFT_INPUT_PIN  (via drill 0.6)
  Top 0.61: v44.45,34.54 36.07,42.93 36.07,47.75 J5.6
  Bottom 0.406: 57.15,34.54 v44.45,34.54
  Bottom 0.61: IC6.14 58.42,33.27 57.15,34.54
SHIFT_STORAGE_PIN  (via drill 0.6)
  Top 0.61: v44.7,29.46 30.99,43.18 30.99,47.75 J5.10
  Bottom 0.406: 57.4,29.46 v44.7,29.46
  Bottom 0.61: IC6.12 58.67,28.19 57.4,29.46
STYLUS_BTN
  Top 0.61: R2.1 39.12,24.13 42.16,27.18 42.16,27.43 26.67,42.93 26.67,48.01 J5.14
  Bottom 0.61: JP2.3 8.38,21.59 9.91,23.11 R2.1
STYLUS_LED
  Bottom 0.61: R1.1 7.11,44.7 10.16,47.75 23.37,47.75 J5.16
(copper drawn outside any net)
  shapes: Bottom circle x10, Top circle x45

### Text on the board
Top: Command Matrix Shield | COMMAND | Exclusively for ChipKit | MATRIX | SHIELD | Voidstar Lab | for ChipKit | v0.2 | If you don't hack it | Created by Zack Freedman | and built at the MakerBar | you don't own it!
Bottom: by Zack Freedman | Voidstar Lab
Unrouted: Add holes without annuli | Change to SOIC